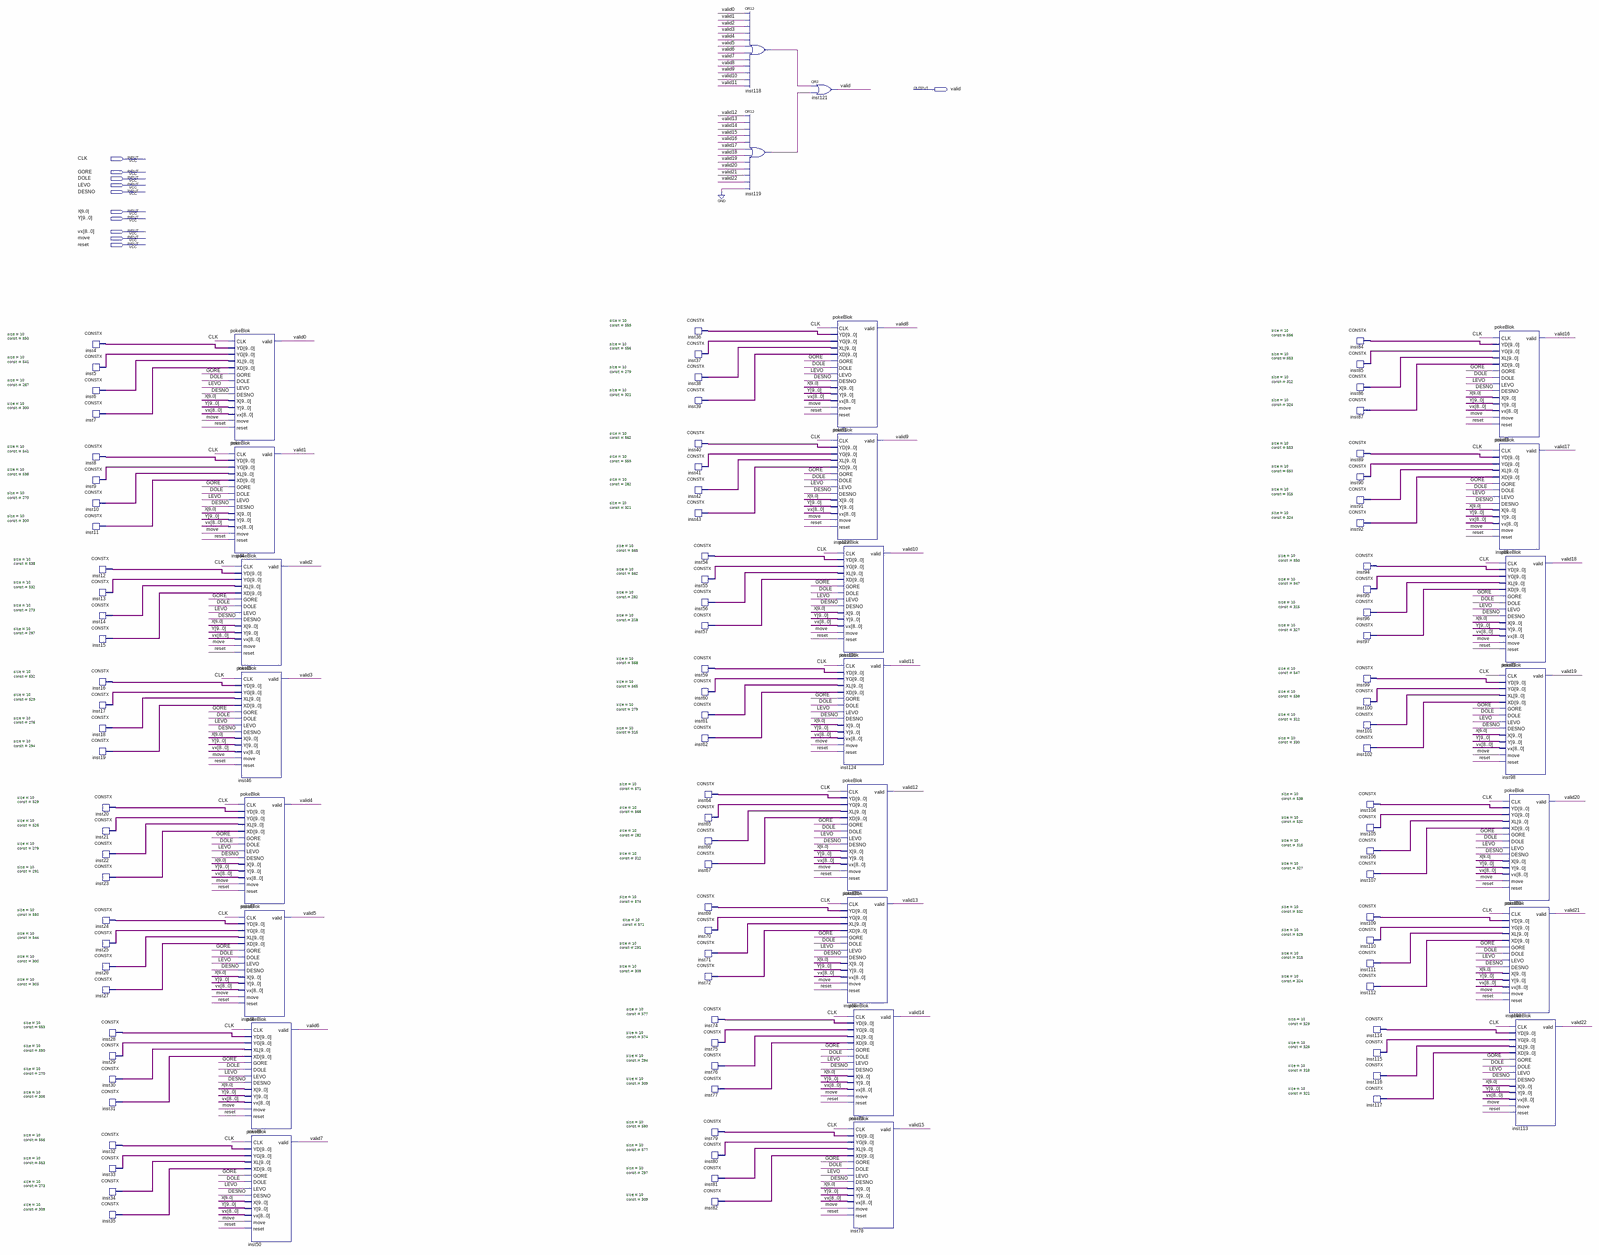
[diagram p0: schematic sheet, whole]
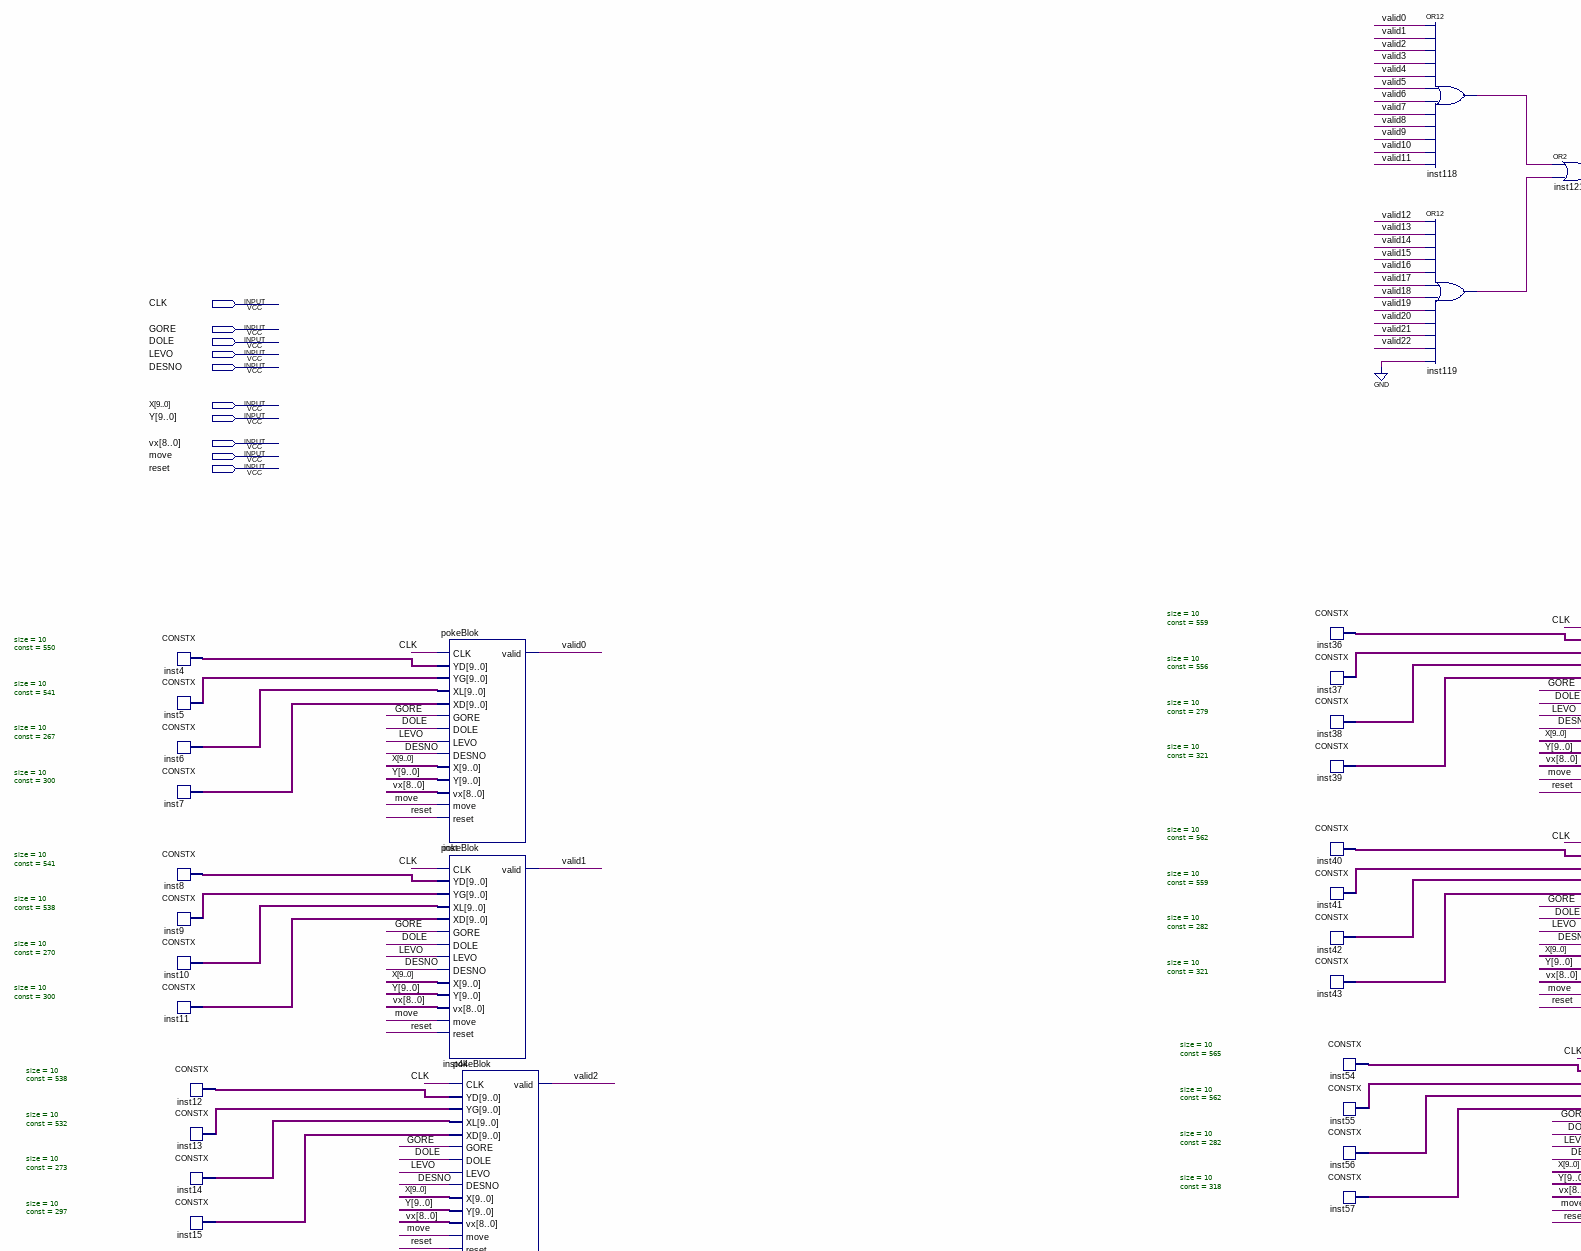
[diagram p1: schematic sheet, upper left part]
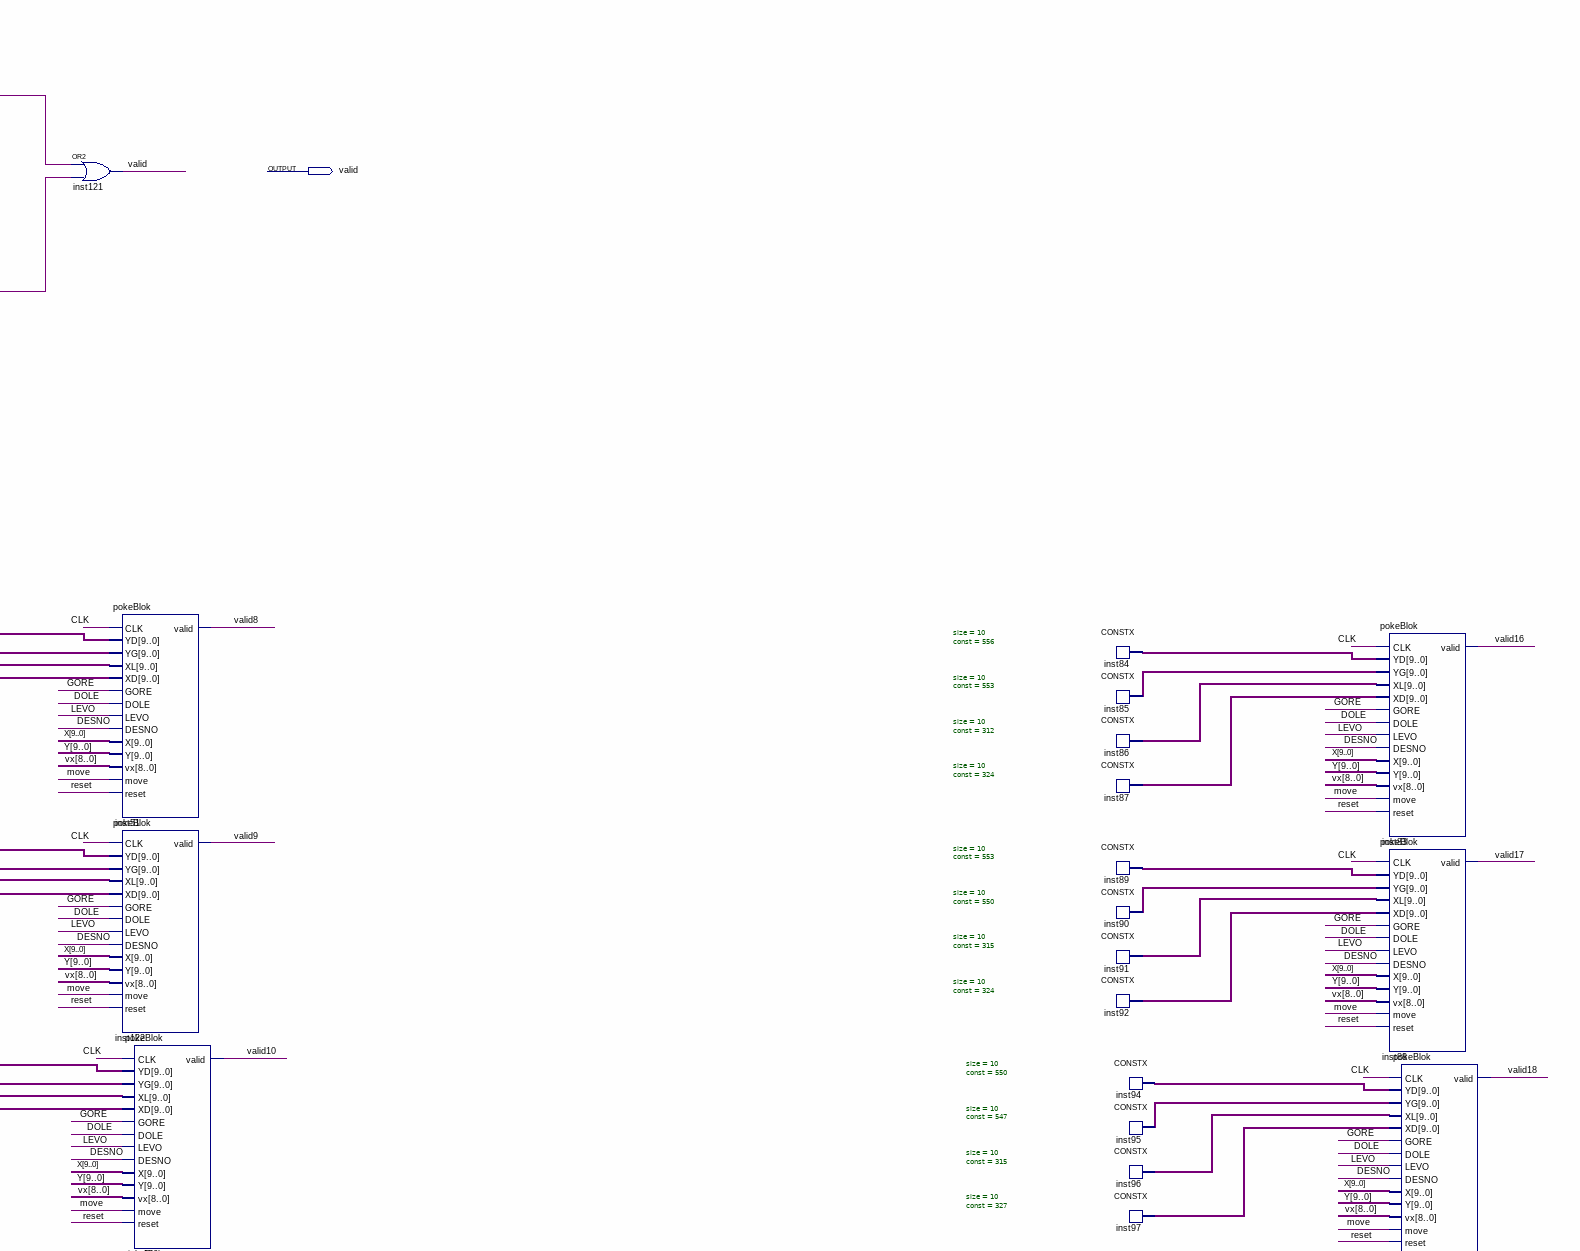
[diagram p2: schematic sheet, upper right part]
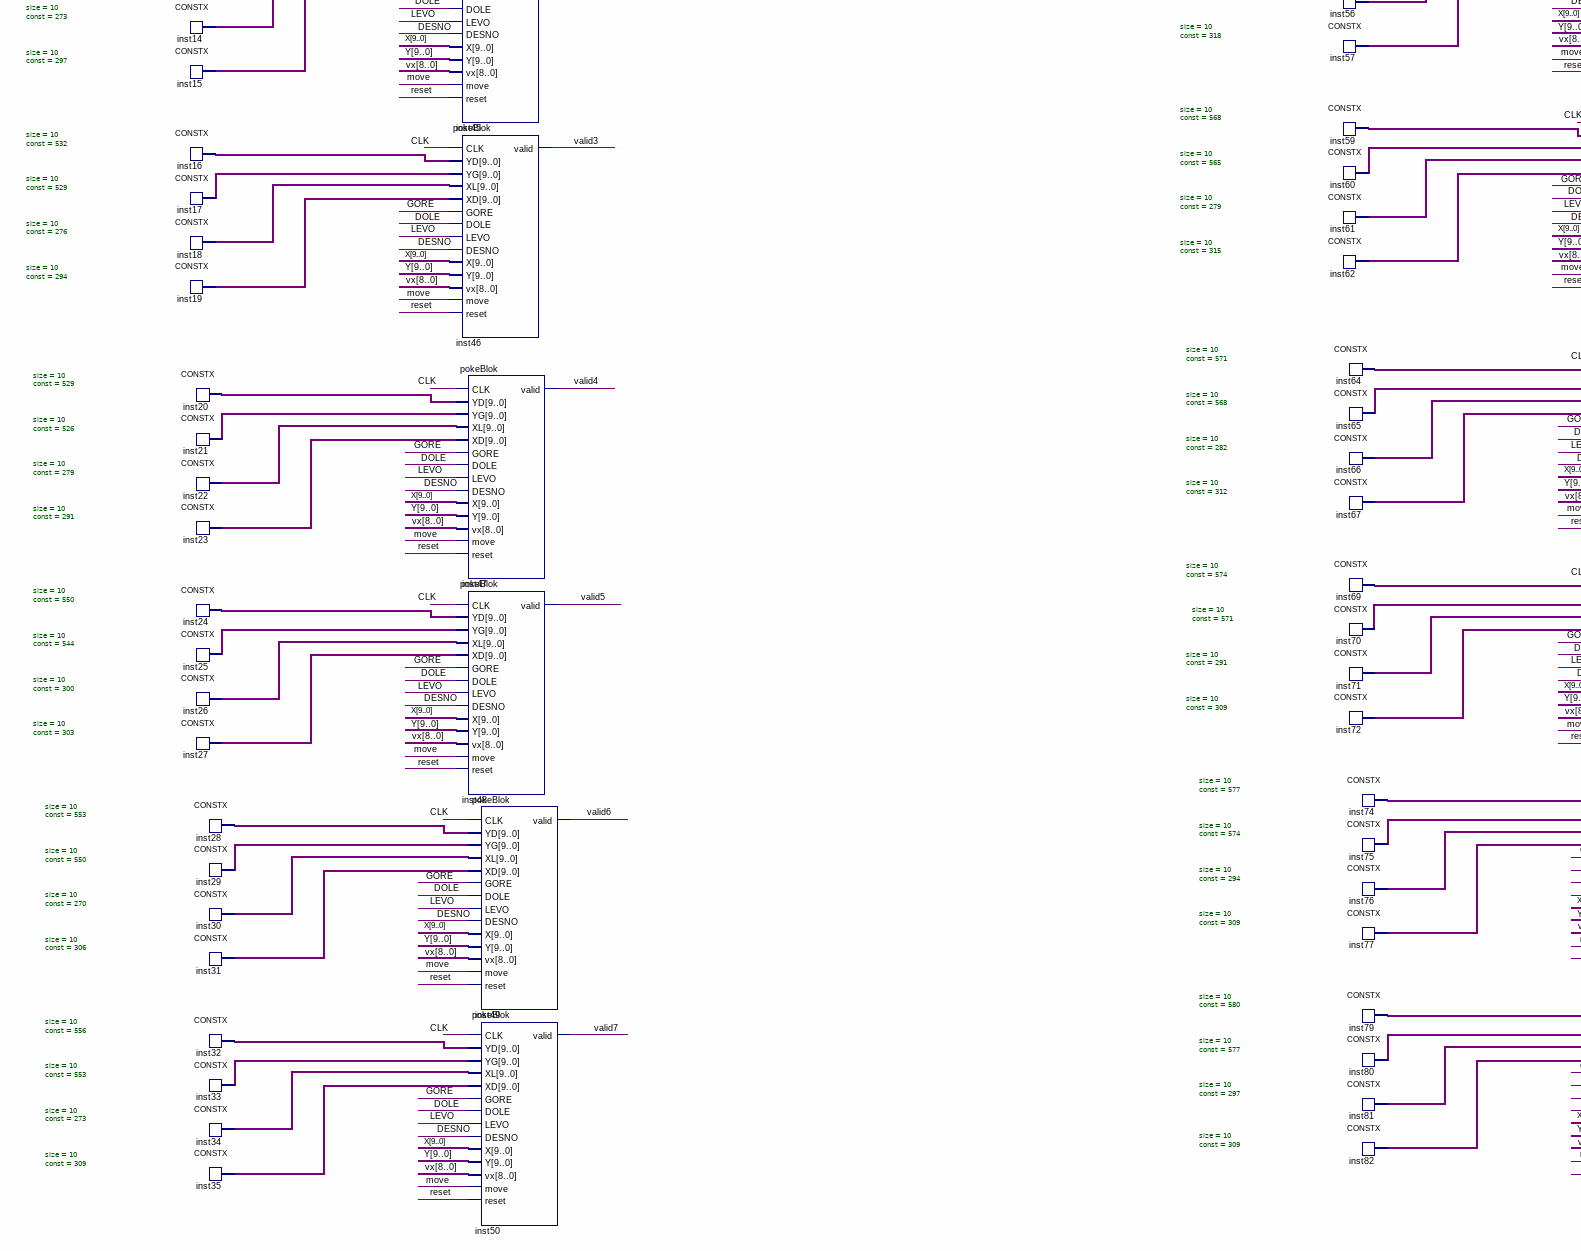
[diagram p3: schematic sheet, lower left part]
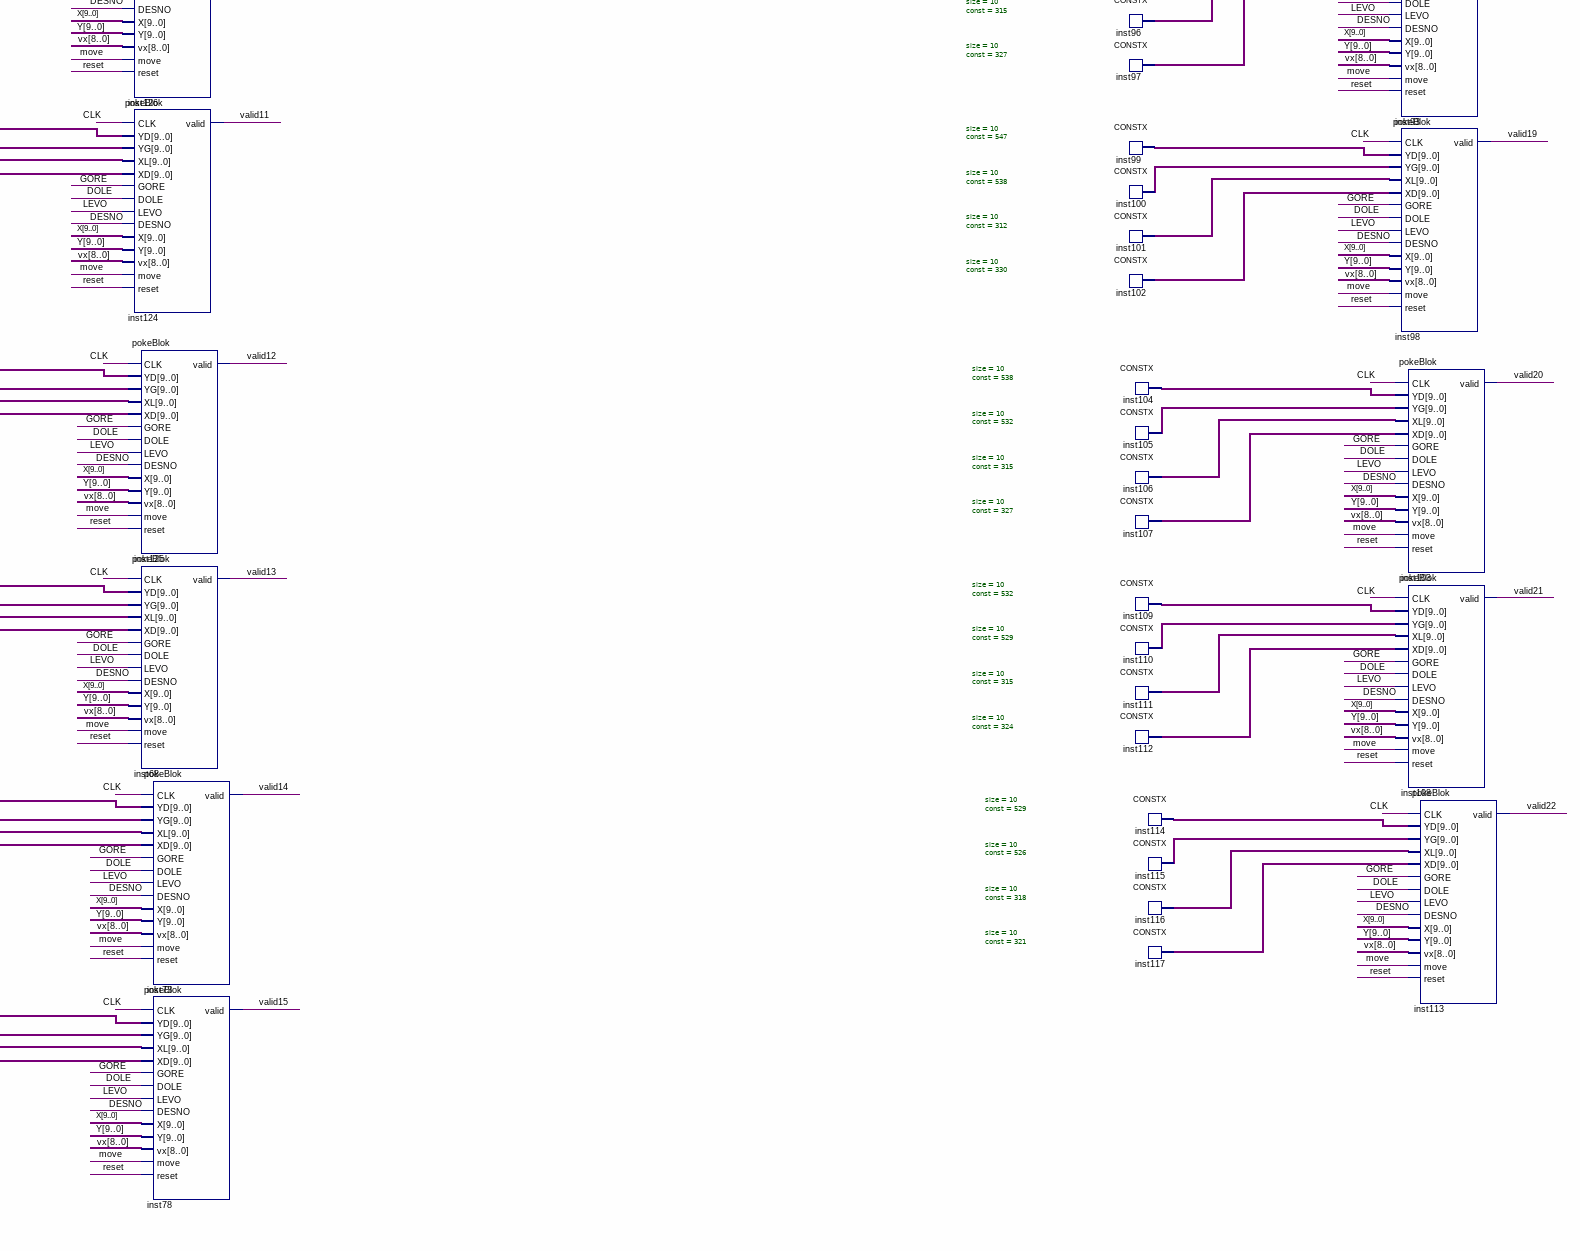
[diagram p4: schematic sheet, lower right part]
// Quartus schematic crniPokeBlok2.bdf as structural Verilog: 118 symbols, 11 pins
module crniPokeBlok2 (
  input  CLK,
  input  GORE,
  input  DOLE,
  input  LEVO,
  input  DESNO,
  input  [9:0] X,
  input  [9:0] Y,
  input  [8:0] vx,
  input  move,
  input  reset,
  output valid
);

  wire inst118_out, inst119_out, valid0, valid1, valid2, valid3, valid4, valid5, valid6, valid7, valid8,
       valid9, valid10, valid11, valid12, valid13, valid14, valid15, valid16, valid17, valid18, valid19,
       valid20, valid21, valid22;
  wire [9:0] inst4_data, inst5_data, inst6_data, inst7_data, inst8_data, inst9_data, inst10_data,
       inst11_data, inst12_data, inst13_data, inst14_data, inst15_data, inst16_data, inst17_data,
       inst18_data, inst19_data, inst20_data, inst21_data, inst22_data, inst23_data, inst24_data,
       inst25_data, inst26_data, inst27_data, inst28_data, inst29_data, inst30_data, inst31_data,
       inst32_data, inst33_data, inst34_data, inst35_data, inst36_data, inst37_data, inst38_data,
       inst39_data, inst40_data, inst41_data, inst42_data, inst43_data, inst54_data, inst55_data,
       inst56_data, inst57_data, inst59_data, inst60_data, inst61_data, inst62_data, inst64_data,
       inst65_data, inst66_data, inst67_data, inst69_data, inst70_data, inst71_data, inst72_data,
       inst74_data, inst75_data, inst76_data, inst77_data, inst79_data, inst80_data, inst81_data,
       inst82_data, inst84_data, inst85_data, inst86_data, inst87_data, inst89_data, inst90_data,
       inst91_data, inst92_data, inst94_data, inst95_data, inst96_data, inst97_data, inst99_data,
       inst100_data, inst101_data, inst102_data, inst104_data, inst105_data, inst106_data, inst107_data,
       inst109_data, inst110_data, inst111_data, inst112_data, inst114_data, inst115_data, inst116_data,
       inst117_data;

  CONSTX #(.size(10), .\const (550)) inst4 (.data(inst4_data));
  CONSTX #(.size(10), .\const (541)) inst5 (.data(inst5_data));
  CONSTX #(.size(10), .\const (267)) inst6 (.data(inst6_data));
  CONSTX #(.size(10), .\const (300)) inst7 (.data(inst7_data));
  CONSTX #(.size(10), .\const (541)) inst8 (.data(inst8_data));
  CONSTX #(.size(10), .\const (538)) inst9 (.data(inst9_data));
  CONSTX #(.size(10), .\const (270)) inst10 (.data(inst10_data));
  CONSTX #(.size(10), .\const (300)) inst11 (.data(inst11_data));
  CONSTX #(.size(10), .\const (538)) inst12 (.data(inst12_data));
  CONSTX #(.size(10), .\const (532)) inst13 (.data(inst13_data));
  CONSTX #(.size(10), .\const (273)) inst14 (.data(inst14_data));
  CONSTX #(.size(10), .\const (297)) inst15 (.data(inst15_data));
  CONSTX #(.size(10), .\const (532)) inst16 (.data(inst16_data));
  CONSTX #(.size(10), .\const (529)) inst17 (.data(inst17_data));
  CONSTX #(.size(10), .\const (276)) inst18 (.data(inst18_data));
  CONSTX #(.size(10), .\const (294)) inst19 (.data(inst19_data));
  CONSTX #(.size(10), .\const (529)) inst20 (.data(inst20_data));
  CONSTX #(.size(10), .\const (526)) inst21 (.data(inst21_data));
  CONSTX #(.size(10), .\const (279)) inst22 (.data(inst22_data));
  CONSTX #(.size(10), .\const (291)) inst23 (.data(inst23_data));
  CONSTX #(.size(10), .\const (550)) inst24 (.data(inst24_data));
  CONSTX #(.size(10), .\const (544)) inst25 (.data(inst25_data));
  CONSTX #(.size(10), .\const (300)) inst26 (.data(inst26_data));
  CONSTX #(.size(10), .\const (303)) inst27 (.data(inst27_data));
  CONSTX #(.size(10), .\const (553)) inst28 (.data(inst28_data));
  CONSTX #(.size(10), .\const (550)) inst29 (.data(inst29_data));
  CONSTX #(.size(10), .\const (270)) inst30 (.data(inst30_data));
  CONSTX #(.size(10), .\const (306)) inst31 (.data(inst31_data));
  CONSTX #(.size(10), .\const (556)) inst32 (.data(inst32_data));
  CONSTX #(.size(10), .\const (553)) inst33 (.data(inst33_data));
  CONSTX #(.size(10), .\const (273)) inst34 (.data(inst34_data));
  CONSTX #(.size(10), .\const (309)) inst35 (.data(inst35_data));
  pokeBlok inst (
    .CLK(CLK), .YD(inst4_data), .YG(inst5_data), .XL(inst6_data), .XD(inst7_data), .GORE(GORE), .DOLE(DOLE),
    .LEVO(LEVO), .DESNO(DESNO), .X(X), .Y(Y), .vx(vx), .move(move), .reset(reset), .valid(valid0));
  pokeBlok inst44 (
    .CLK(CLK), .YD(inst8_data), .YG(inst9_data), .XL(inst10_data), .XD(inst11_data), .GORE(GORE),
    .DOLE(DOLE), .LEVO(LEVO), .DESNO(DESNO), .X(X), .Y(Y), .vx(vx), .move(move), .reset(reset), .valid(valid1));
  pokeBlok inst45 (
    .CLK(CLK), .YD(inst12_data), .YG(inst13_data), .XL(inst14_data), .XD(inst15_data), .GORE(GORE),
    .DOLE(DOLE), .LEVO(LEVO), .DESNO(DESNO), .X(X), .Y(Y), .vx(vx), .move(move), .reset(reset), .valid(valid2));
  pokeBlok inst46 (
    .CLK(CLK), .YD(inst16_data), .YG(inst17_data), .XL(inst18_data), .XD(inst19_data), .GORE(GORE),
    .DOLE(DOLE), .LEVO(LEVO), .DESNO(DESNO), .X(X), .Y(Y), .vx(vx), .move(move), .reset(reset), .valid(valid3));
  pokeBlok inst47 (
    .CLK(CLK), .YD(inst20_data), .YG(inst21_data), .XL(inst22_data), .XD(inst23_data), .GORE(GORE),
    .DOLE(DOLE), .LEVO(LEVO), .DESNO(DESNO), .X(X), .Y(Y), .vx(vx), .move(move), .reset(reset), .valid(valid4));
  pokeBlok inst48 (
    .CLK(CLK), .YD(inst24_data), .YG(inst25_data), .XL(inst26_data), .XD(inst27_data), .GORE(GORE),
    .DOLE(DOLE), .LEVO(LEVO), .DESNO(DESNO), .X(X), .Y(Y), .vx(vx), .move(move), .reset(reset), .valid(valid5));
  pokeBlok inst49 (
    .CLK(CLK), .YD(inst28_data), .YG(inst29_data), .XL(inst30_data), .XD(inst31_data), .GORE(GORE),
    .DOLE(DOLE), .LEVO(LEVO), .DESNO(DESNO), .X(X), .Y(Y), .vx(vx), .move(move), .reset(reset), .valid(valid6));
  pokeBlok inst50 (
    .CLK(CLK), .YD(inst32_data), .YG(inst33_data), .XL(inst34_data), .XD(inst35_data), .GORE(GORE),
    .DOLE(DOLE), .LEVO(LEVO), .DESNO(DESNO), .X(X), .Y(Y), .vx(vx), .move(move), .reset(reset), .valid(valid7));
  CONSTX #(.size(10), .\const (559)) inst36 (.data(inst36_data));
  CONSTX #(.size(10), .\const (556)) inst37 (.data(inst37_data));
  CONSTX #(.size(10), .\const (279)) inst38 (.data(inst38_data));
  CONSTX #(.size(10), .\const (321)) inst39 (.data(inst39_data));
  CONSTX #(.size(10), .\const (562)) inst40 (.data(inst40_data));
  CONSTX #(.size(10), .\const (559)) inst41 (.data(inst41_data));
  CONSTX #(.size(10), .\const (282)) inst42 (.data(inst42_data));
  CONSTX #(.size(10), .\const (321)) inst43 (.data(inst43_data));
  CONSTX #(.size(10), .\const (565)) inst54 (.data(inst54_data));
  CONSTX #(.size(10), .\const (562)) inst55 (.data(inst55_data));
  CONSTX #(.size(10), .\const (282)) inst56 (.data(inst56_data));
  CONSTX #(.size(10), .\const (318)) inst57 (.data(inst57_data));
  CONSTX #(.size(10), .\const (568)) inst59 (.data(inst59_data));
  CONSTX #(.size(10), .\const (565)) inst60 (.data(inst60_data));
  CONSTX #(.size(10), .\const (279)) inst61 (.data(inst61_data));
  CONSTX #(.size(10), .\const (315)) inst62 (.data(inst62_data));
  CONSTX #(.size(10), .\const (571)) inst64 (.data(inst64_data));
  CONSTX #(.size(10), .\const (568)) inst65 (.data(inst65_data));
  CONSTX #(.size(10), .\const (282)) inst66 (.data(inst66_data));
  CONSTX #(.size(10), .\const (312)) inst67 (.data(inst67_data));
  CONSTX #(.size(10), .\const (574)) inst69 (.data(inst69_data));
  CONSTX #(.size(10), .\const (571)) inst70 (.data(inst70_data));
  CONSTX #(.size(10), .\const (291)) inst71 (.data(inst71_data));
  CONSTX #(.size(10), .\const (309)) inst72 (.data(inst72_data));
  CONSTX #(.size(10), .\const (577)) inst74 (.data(inst74_data));
  CONSTX #(.size(10), .\const (574)) inst75 (.data(inst75_data));
  CONSTX #(.size(10), .\const (294)) inst76 (.data(inst76_data));
  CONSTX #(.size(10), .\const (309)) inst77 (.data(inst77_data));
  CONSTX #(.size(10), .\const (580)) inst79 (.data(inst79_data));
  CONSTX #(.size(10), .\const (577)) inst80 (.data(inst80_data));
  CONSTX #(.size(10), .\const (297)) inst81 (.data(inst81_data));
  CONSTX #(.size(10), .\const (309)) inst82 (.data(inst82_data));
  or inst118 (inst118_out, valid0, valid1, valid2, valid3, valid4, valid5, valid6, valid7, valid8, valid9, valid10, valid11);
  or inst119 (inst119_out, valid12, valid13, valid14, valid15, valid16, valid17, valid18, valid19, valid20, valid21, valid22, 1'b0);
  or inst121 (valid, inst118_out, inst119_out);
  pokeBlok inst51 (
    .CLK(CLK), .YD(inst36_data), .YG(inst37_data), .XL(inst38_data), .XD(inst39_data), .GORE(GORE),
    .DOLE(DOLE), .LEVO(LEVO), .DESNO(DESNO), .X(X), .Y(Y), .vx(vx), .move(move), .reset(reset), .valid(valid8));
  pokeBlok inst122 (
    .CLK(CLK), .YD(inst40_data), .YG(inst41_data), .XL(inst42_data), .XD(inst43_data), .GORE(GORE),
    .DOLE(DOLE), .LEVO(LEVO), .DESNO(DESNO), .X(X), .Y(Y), .vx(vx), .move(move), .reset(reset), .valid(valid9));
  pokeBlok inst126 (
    .CLK(CLK), .YD(inst54_data), .YG(inst55_data), .XL(inst56_data), .XD(inst57_data), .GORE(GORE),
    .DOLE(DOLE), .LEVO(LEVO), .DESNO(DESNO), .X(X), .Y(Y), .vx(vx), .move(move), .reset(reset),
    .valid(valid10));
  pokeBlok inst124 (
    .CLK(CLK), .YD(inst59_data), .YG(inst60_data), .XL(inst61_data), .XD(inst62_data), .GORE(GORE),
    .DOLE(DOLE), .LEVO(LEVO), .DESNO(DESNO), .X(X), .Y(Y), .vx(vx), .move(move), .reset(reset),
    .valid(valid11));
  pokeBlok inst125 (
    .CLK(CLK), .YD(inst64_data), .YG(inst65_data), .XL(inst66_data), .XD(inst67_data), .GORE(GORE),
    .DOLE(DOLE), .LEVO(LEVO), .DESNO(DESNO), .X(X), .Y(Y), .vx(vx), .move(move), .reset(reset),
    .valid(valid12));
  pokeBlok inst68 (
    .CLK(CLK), .YD(inst69_data), .YG(inst70_data), .XL(inst71_data), .XD(inst72_data), .GORE(GORE),
    .DOLE(DOLE), .LEVO(LEVO), .DESNO(DESNO), .X(X), .Y(Y), .vx(vx), .move(move), .reset(reset),
    .valid(valid13));
  pokeBlok inst73 (
    .CLK(CLK), .YD(inst74_data), .YG(inst75_data), .XL(inst76_data), .XD(inst77_data), .GORE(GORE),
    .DOLE(DOLE), .LEVO(LEVO), .DESNO(DESNO), .X(X), .Y(Y), .vx(vx), .move(move), .reset(reset),
    .valid(valid14));
  pokeBlok inst78 (
    .CLK(CLK), .YD(inst79_data), .YG(inst80_data), .XL(inst81_data), .XD(inst82_data), .GORE(GORE),
    .DOLE(DOLE), .LEVO(LEVO), .DESNO(DESNO), .X(X), .Y(Y), .vx(vx), .move(move), .reset(reset),
    .valid(valid15));
  CONSTX #(.size(10), .\const (556)) inst84 (.data(inst84_data));
  CONSTX #(.size(10), .\const (553)) inst85 (.data(inst85_data));
  CONSTX #(.size(10), .\const (312)) inst86 (.data(inst86_data));
  CONSTX #(.size(10), .\const (324)) inst87 (.data(inst87_data));
  CONSTX #(.size(10), .\const (553)) inst89 (.data(inst89_data));
  CONSTX #(.size(10), .\const (550)) inst90 (.data(inst90_data));
  CONSTX #(.size(10), .\const (315)) inst91 (.data(inst91_data));
  CONSTX #(.size(10), .\const (324)) inst92 (.data(inst92_data));
  CONSTX #(.size(10), .\const (550)) inst94 (.data(inst94_data));
  CONSTX #(.size(10), .\const (547)) inst95 (.data(inst95_data));
  CONSTX #(.size(10), .\const (315)) inst96 (.data(inst96_data));
  CONSTX #(.size(10), .\const (327)) inst97 (.data(inst97_data));
  CONSTX #(.size(10), .\const (547)) inst99 (.data(inst99_data));
  CONSTX #(.size(10), .\const (538)) inst100 (.data(inst100_data));
  CONSTX #(.size(10), .\const (312)) inst101 (.data(inst101_data));
  CONSTX #(.size(10), .\const (330)) inst102 (.data(inst102_data));
  CONSTX #(.size(10), .\const (538)) inst104 (.data(inst104_data));
  CONSTX #(.size(10), .\const (532)) inst105 (.data(inst105_data));
  CONSTX #(.size(10), .\const (315)) inst106 (.data(inst106_data));
  CONSTX #(.size(10), .\const (327)) inst107 (.data(inst107_data));
  CONSTX #(.size(10), .\const (532)) inst109 (.data(inst109_data));
  CONSTX #(.size(10), .\const (529)) inst110 (.data(inst110_data));
  CONSTX #(.size(10), .\const (315)) inst111 (.data(inst111_data));
  CONSTX #(.size(10), .\const (324)) inst112 (.data(inst112_data));
  CONSTX #(.size(10), .\const (529)) inst114 (.data(inst114_data));
  CONSTX #(.size(10), .\const (526)) inst115 (.data(inst115_data));
  CONSTX #(.size(10), .\const (318)) inst116 (.data(inst116_data));
  CONSTX #(.size(10), .\const (321)) inst117 (.data(inst117_data));
  pokeBlok inst83 (
    .CLK(CLK), .YD(inst84_data), .YG(inst85_data), .XL(inst86_data), .XD(inst87_data), .GORE(GORE),
    .DOLE(DOLE), .LEVO(LEVO), .DESNO(DESNO), .X(X), .Y(Y), .vx(vx), .move(move), .reset(reset),
    .valid(valid16));
  pokeBlok inst88 (
    .CLK(CLK), .YD(inst89_data), .YG(inst90_data), .XL(inst91_data), .XD(inst92_data), .GORE(GORE),
    .DOLE(DOLE), .LEVO(LEVO), .DESNO(DESNO), .X(X), .Y(Y), .vx(vx), .move(move), .reset(reset),
    .valid(valid17));
  pokeBlok inst93 (
    .CLK(CLK), .YD(inst94_data), .YG(inst95_data), .XL(inst96_data), .XD(inst97_data), .GORE(GORE),
    .DOLE(DOLE), .LEVO(LEVO), .DESNO(DESNO), .X(X), .Y(Y), .vx(vx), .move(move), .reset(reset),
    .valid(valid18));
  pokeBlok inst98 (
    .CLK(CLK), .YD(inst99_data), .YG(inst100_data), .XL(inst101_data), .XD(inst102_data), .GORE(GORE),
    .DOLE(DOLE), .LEVO(LEVO), .DESNO(DESNO), .X(X), .Y(Y), .vx(vx), .move(move), .reset(reset),
    .valid(valid19));
  pokeBlok inst103 (
    .CLK(CLK), .YD(inst104_data), .YG(inst105_data), .XL(inst106_data), .XD(inst107_data), .GORE(GORE),
    .DOLE(DOLE), .LEVO(LEVO), .DESNO(DESNO), .X(X), .Y(Y), .vx(vx), .move(move), .reset(reset),
    .valid(valid20));
  pokeBlok inst108 (
    .CLK(CLK), .YD(inst109_data), .YG(inst110_data), .XL(inst111_data), .XD(inst112_data), .GORE(GORE),
    .DOLE(DOLE), .LEVO(LEVO), .DESNO(DESNO), .X(X), .Y(Y), .vx(vx), .move(move), .reset(reset),
    .valid(valid21));
  pokeBlok inst113 (
    .CLK(CLK), .YD(inst114_data), .YG(inst115_data), .XL(inst116_data), .XD(inst117_data), .GORE(GORE),
    .DOLE(DOLE), .LEVO(LEVO), .DESNO(DESNO), .X(X), .Y(Y), .vx(vx), .move(move), .reset(reset),
    .valid(valid22));
endmodule
